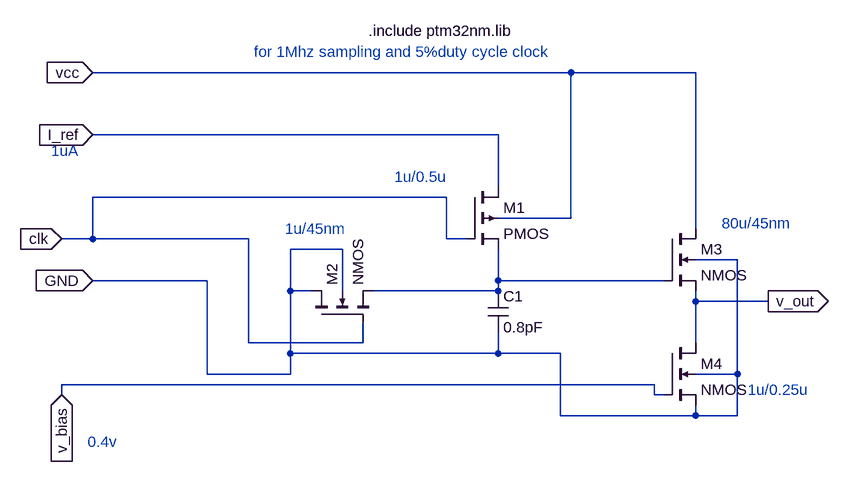
[diagram p0: schematic ramp_ckt_32nm_cd_buffer_ckt.asc]
ramp_ckt_32nm_cd_buffer_ckt.asc, the LTspice schematic file:
Version 4
SHEET 1 1036 680
WIRE 608 -96 -128 -96
WIRE 800 -96 608 -96
WIRE 496 0 -128 0
WIRE 496 80 496 0
WIRE 416 96 -128 96
WIRE 608 128 608 -96
WIRE 608 128 496 128
WIRE 800 144 800 -96
WIRE -128 160 -128 96
WIRE -128 160 -176 160
WIRE 112 160 -128 160
WIRE 416 160 416 96
WIRE 448 160 416 160
WIRE 256 176 176 176
WIRE 864 192 800 192
WIRE 48 224 -128 224
WIRE 496 224 496 176
WIRE 752 224 496 224
WIRE 176 240 176 176
WIRE 208 240 176 240
WIRE 256 240 256 176
WIRE 496 240 496 224
WIRE 496 240 304 240
WIRE 800 256 800 240
WIRE 912 256 800 256
WIRE 112 320 112 160
WIRE 288 320 288 288
WIRE 288 320 112 320
WIRE 800 320 800 256
WIRE 176 336 176 240
WIRE 496 336 496 304
WIRE 496 336 176 336
WIRE 592 336 496 336
WIRE 48 368 48 224
WIRE 176 368 176 336
WIRE 176 368 48 368
WIRE 864 368 864 192
WIRE 864 368 800 368
WIRE 736 384 -176 384
WIRE -176 400 -176 384
WIRE 736 400 736 384
WIRE 752 400 736 400
WIRE 592 432 592 336
WIRE 800 432 800 416
WIRE 800 432 592 432
WIRE 864 432 864 368
WIRE 864 432 800 432
FLAG -128 0 I_ref
IOPIN -128 0 In
FLAG -176 160 clk
IOPIN -176 160 In
FLAG -128 -96 vcc
IOPIN -128 -96 In
FLAG -128 224 GND
IOPIN -128 224 In
FLAG -176 400 v_bias
IOPIN -176 400 In
FLAG 912 256 v_out
IOPIN 912 256 Out
SYMBOL pmos4 448 80 R0
SYMATTR InstName M1
SYMATTR Value2 l=0.5u w=1u
SYMBOL nmos4 208 288 R270
SYMATTR InstName M2
SYMATTR Value2 l=45nm w=1u
SYMBOL cap 480 240 R0
SYMATTR InstName C1
SYMATTR Value 0.8pF
SYMBOL nmos4 752 144 R0
SYMATTR InstName M3
SYMATTR Value2 l=45nm w=80u
SYMBOL nmos4 752 320 R0
SYMATTR InstName M4
SYMATTR Value2 l=0.25u w=1.5u
TEXT 296 -160 Left 2 !.include ptm32nm.lib
TEXT 336 64 Left 2 ;1u/0.5u
TEXT 168 144 Left 2 ;1u/45nm
TEXT 840 136 Left 2 ;80u/45nm
TEXT 880 392 Left 2 ;1u/0.25u
TEXT 120 -128 Left 2 ;for 1Mhz sampling and 5%duty cycle clock
TEXT -192 24 Left 2 ;1uA
TEXT -136 472 Left 2 ;0.4v

The netlist it stands for:
* ramp_ckt_32nm_cd_buffer_ckt.asc
M1 I_ref clk N001 vcc PMOS l=0.5u w=1u
M2 GND clk N001 GND NMOS l=45nm w=1u
C1 N001 GND 0.8pF
M3 vcc N001 v_out GND NMOS l=45nm w=80u
M4 v_out v_bias GND GND NMOS l=0.25u w=1.5u
.model NMOS NMOS
.model PMOS PMOS
.lib standard.mos
.include ptm32nm.lib
* 1u/0.5u
* 1u/45nm
* 80u/45nm
* 1u/0.25u
* for 1Mhz sampling and 5%duty cycle clock
* 1uA
* 0.4v
.backanno
.end